# EAGLE design 12v-5v_Buck_Converter (EAGLE 9.6.2)
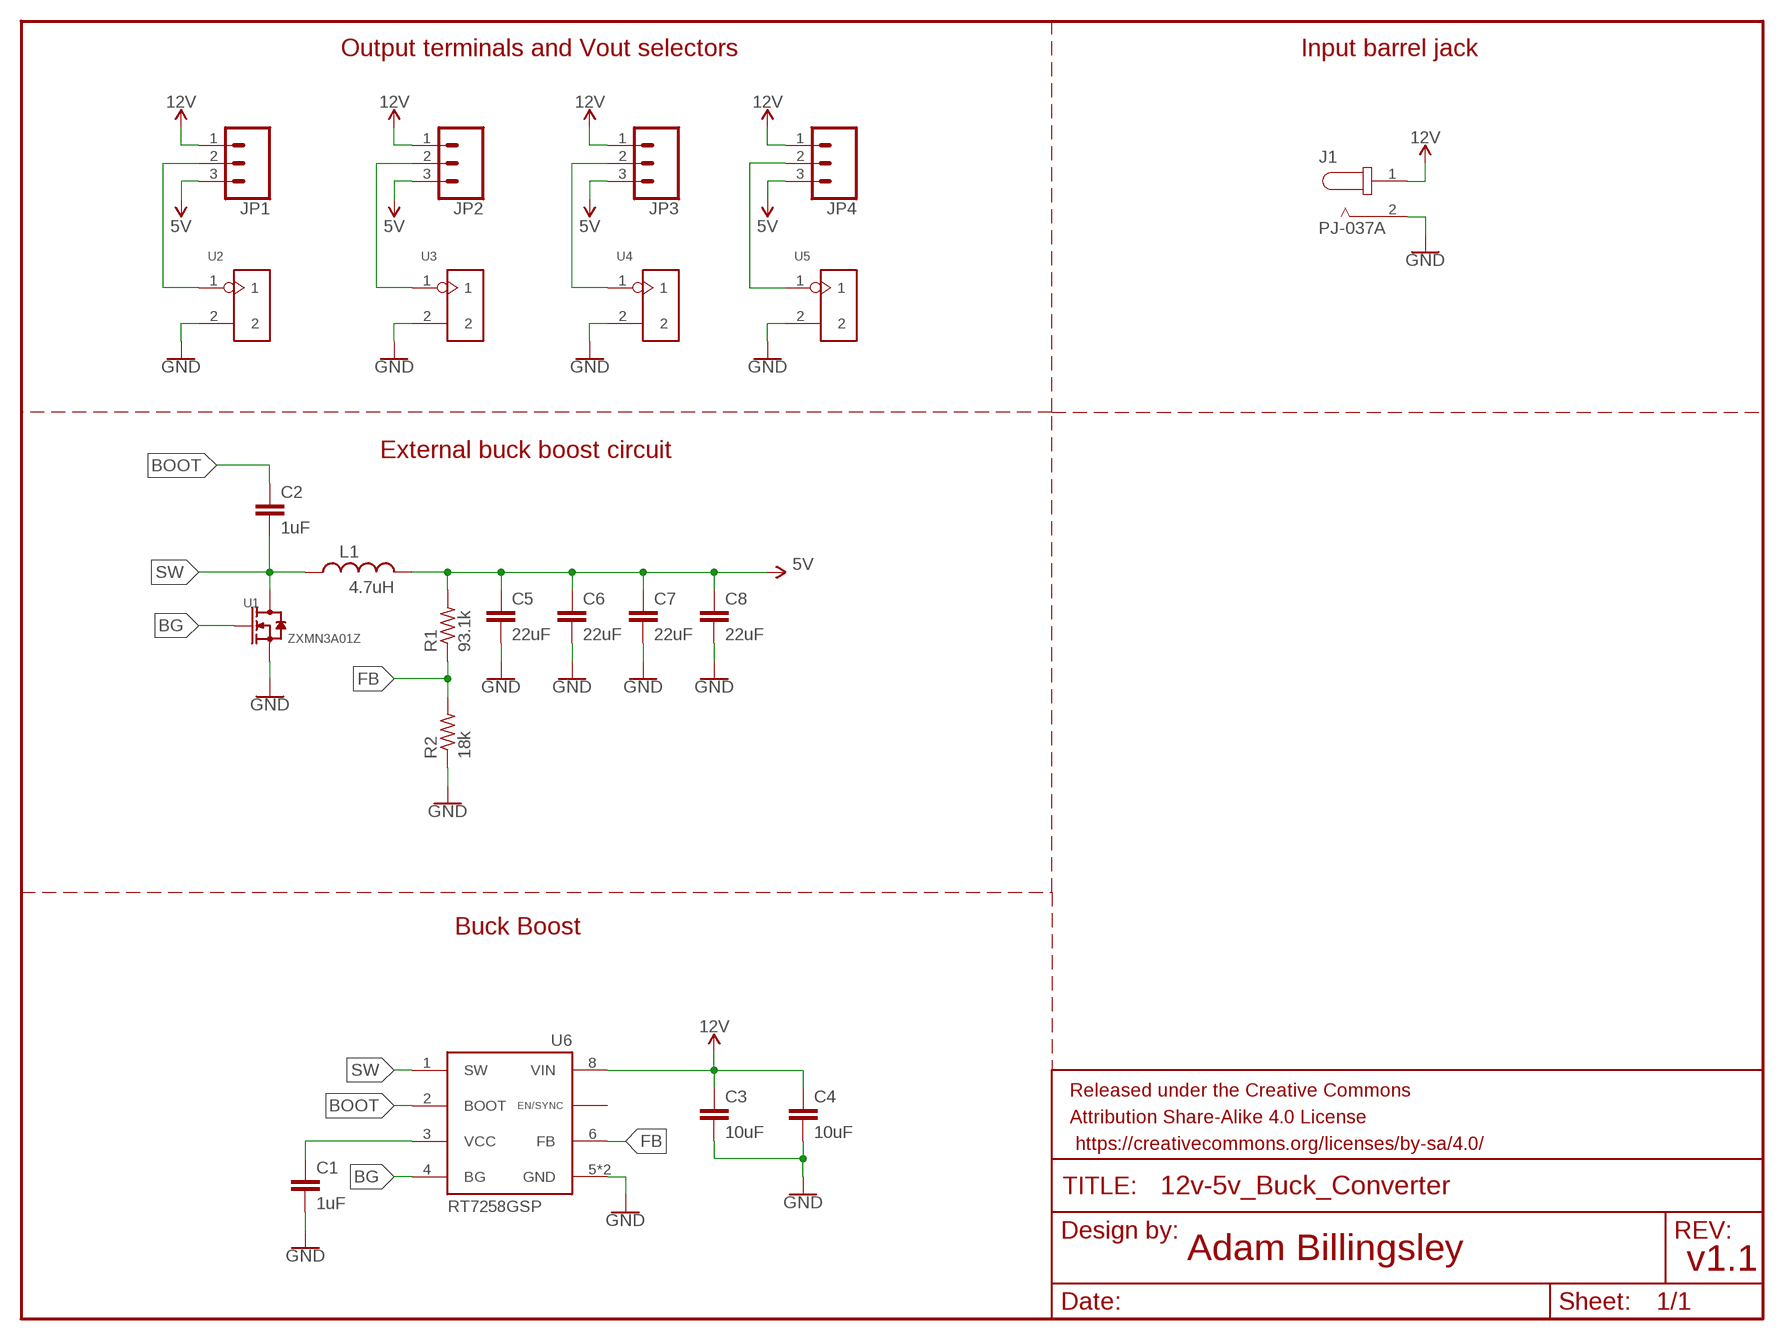
[diagram p0: schematic, sheet 1]

## Parts
C1  1uF  1206_CAPACITOR  [1206-CAPACITOR]
C2  1uF  1206_CAPACITOR  [1206-CAPACITOR]
C3  10uF  1206_CAPACITOR  [1206-CAPACITOR]
C4  10uF  1206_CAPACITOR  [1206-CAPACITOR]
C5  22uF  1210_CAPACITOR  [1210]
C6  22uF  1210_CAPACITOR  [1210]
C7  22uF  1210_CAPACITOR  [1210]
C8  22uF  1210_CAPACITOR  [1210]
FRAME1  FRAME-LETTER  [CREATIVE_COMMONS]
J1  PJ-037A  [CUI_PJ-037A]
JP1  1X03  [1X03]
JP2  1X03  [1X03]
JP3  1X03  [1X03]
JP4  1X03  [1X03]
L1  4.7uH  INDUCTOR_7443330470  [INDUCTOR-7443330470]
R1  93.1k  1206_RESISTOR  [1206-CAPACITOR]
R2  18k  1206_RESISTOR  [1206-CAPACITOR]
U1  ZXMN3A01Z  MOSFET-N-SI7114DN  [SI7114DN]
U2  TERMINAL_BLOCK_2P  [H2-5.0-10.5X8.0MM]
U3  TERMINAL_BLOCK_2P  [H2-5.0-10.5X8.0MM]
U4  TERMINAL_BLOCK_2P  [H2-5.0-10.5X8.0MM]
U5  TERMINAL_BLOCK_2P  [H2-5.0-10.5X8.0MM]
U6  RT7258GSP  [SOP-8E]

## Nets
5V: C5.1 C6.1 C7.1 C8.1 JP1.3 JP2.3 JP3.3 JP4.3 L1.2 R1.2
12V: C3.1 C4.1 J1.1 JP1.1 JP2.1 JP3.1 JP4.1 U6.8(VIN)
BG: U1.4(G) U6.4(BG)
BOOT: C2.1 U6.2(BOOT)
FB: R1.1 R2.2 U6.6(FB)
GND: C1.2 C3.2 C4.2 C5.2 C6.2 C7.2 C8.2 J1.2 R2.1 U1.1(S) U1.2(S) U1.3(S) U2.2 U3.2 U4.2 U5.2 U6.5(GND) U6.9(GND)
N$1: C1.1 U6.3(VCC)
N$2: JP4.2 U5.1
N$3: JP3.2 U4.1
N$4: JP2.2 U3.1
N$5: JP1.2 U2.1
SW: C2.2 L1.1 U1.5(D) U1.6(D) U1.7(D) U1.8(D) U1.9(D) U6.1(SW)
Unconnected: U6.7(EN/SYNC)

## Notes on the sheet
- Output terminals and Vout selectors | Input barrel jack
- External buck boost circuit
- Buck Boost
- Adam Billingsley
- v1.1

## Library data of the parts
C1-C4 = Adam's Parts (work):1206_CAPACITOR
C5-C8 = Adam's Parts (work):1210_CAPACITOR
FRAME1 = SparkFun-Aesthetics:FRAME-LETTER: Schematic Frame - Letter Standard 8.5x11 US Letter frame
J1 = PJ-037A:PJ-037A: 2.0 mm Center Pin, 2.5 A, Right Angle, Through Hole, Dc Power Jack Connector; MANUFACTURER: CUI INC; STANDARD: Manufacturer recommendations
JP1-JP4 = Adam's Parts (work):1X03
L1 = Adam's Parts (work):INDUCTOR_7443330470
R1 R2 = Adam's Parts (work):1206_RESISTOR
U1 = Adam's Parts (work):MOSFET-N-SI7114DN
U2-U5 = Adam's Parts (work):TERMINAL_BLOCK_2P
U6 = Adam's Parts (work):RT7258GSP

## Board
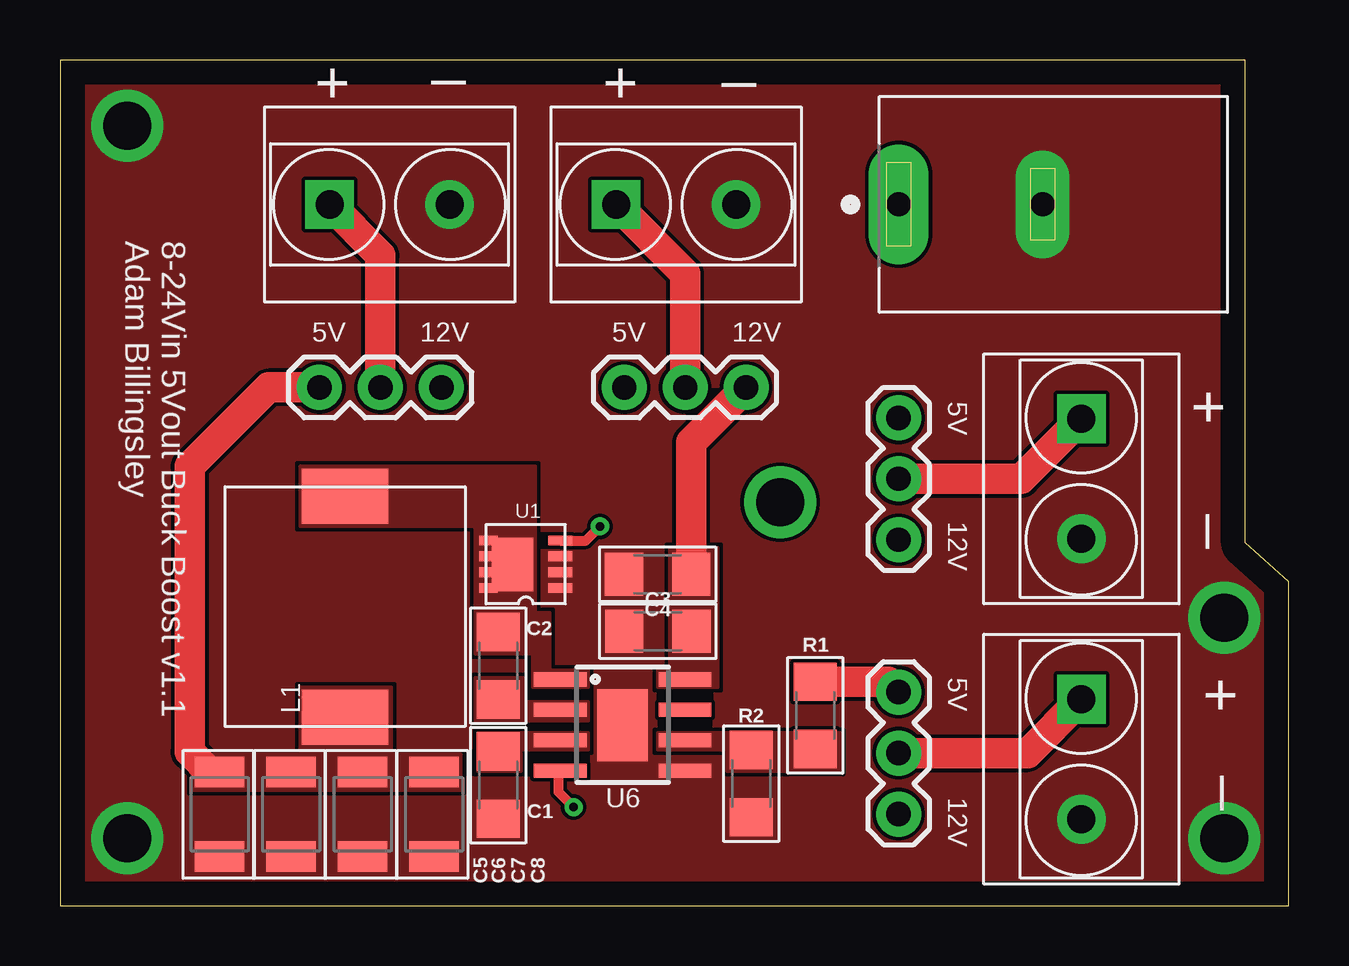
[diagram p1: board, top side]
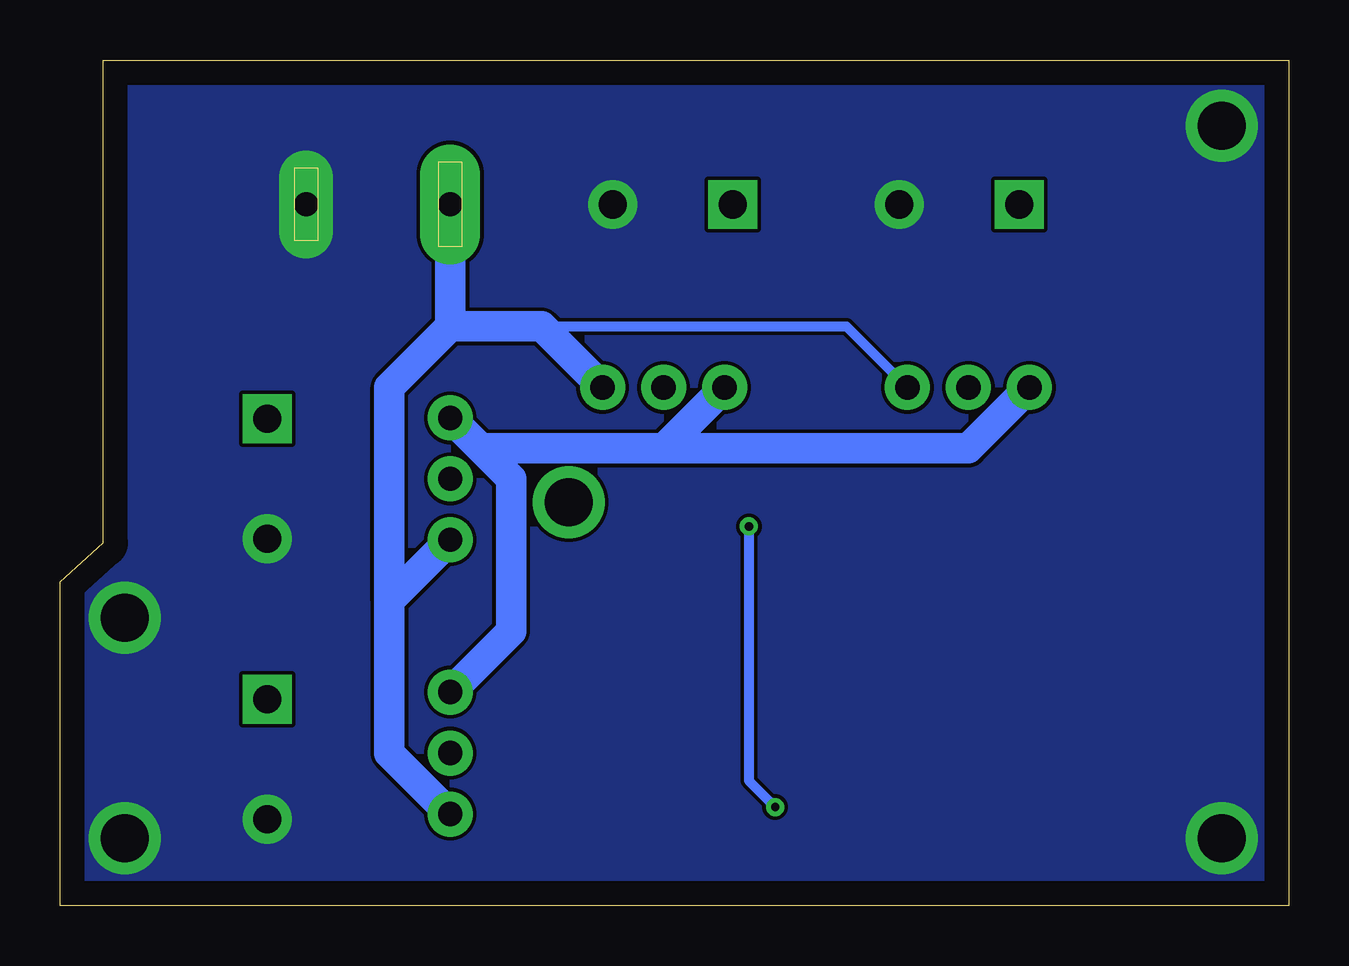
[diagram p2: board, bottom side, seen from below]

Size 51.2 x 35.23 mm. Coordinates in mm from the lower left corner, seen from the top.
Outline: 0,0 51.2,0 51.2,13.5 49.39,15.11 49.39,35.23 0,35.23 0,0
Copper layers (1*16): Top 0.035mm / dielectric 1.5mm / Bottom 0.035mm
Design rules "default": minimum track width 6mil, minimum drill 0.35mm, track to track 6mil, track to pad 6mil, pad to pad 6mil, via to via 6mil, smd to smd 6mil, copper to edge 40mil, drill to drill 6mil, minimum pad ring 10mil, minimum via ring 8mil, stop-mask expansion 4mil, vias tented up to drill 0mil, thermal gap 10mil

### Footprints (pad centres in the part's own frame; a part is rotated, then mirrored left to right if it is on the bottom)
1206-CAPACITOR = smd 1.6 x 1.8: 1 -1.4,0; 2 1.4,0
1210 = smd 1.27 x 2.06: 1 -1.755,0; 2 1.755,0
CUI_PJ-037A = drill 1 pad 2.5 long: 1 0,0 | drill 1 pad 2.25 long: 2 6,0
1X03 = drill 1.016 pad 1.88: 1 0,0; 2 2.54,0; 3 5.08,0
INDUCTOR-7443330470 = smd 2.3 x 3.6: 1 4.6,0; 2 -4.6,0
SI7114DN = smd 0.99 x 0.405: 1 0.495,2.183; 2 0.495,1.522; 3 0.495,0.863; 4 0.495,0.203 | smd 0.76 x 0.405: 5 3.48,0.203; 6 3.48,0.863; 7 3.48,1.522; 8 3.48,2.183 | smd 1.725 x 2.235: 9 2.487,1.195
H2-5.0-10.5X8.0MM = drill 1.168 pad 2.032 square: 1 0,2.5 | drill 1.168 pad 2.032: 2 0,-2.5
SOP-8E = smd 0.6 x 2.2: 1 -1.905,-2.6; 2 -0.635,-2.6; 3 0.635,-2.6; 4 1.905,-2.6; 5 1.905,2.6; 6 0.635,2.6; 7 -0.635,2.6; 8 -1.905,2.6 | smd 3 x 2.1: 9 0,0

### Placement (x,y rotation side)
C1  18.26,5.01 270 top
C2  18.26,9.99 90 top
C3  24.91,11.43 180 top
C4  24.9,13.8 180 top
C5  15.59,3.8 270 top
C6  12.61,3.8 270 top
C7  9.63,3.8 270 top
C8  6.65,3.8 270 top
FRAME1  21,-8 0 bottom  (outside the outline)
J1  34.94,29.21 0 top
JP1  34.94,3.81 90 top
JP2  34.94,15.24 90 top
JP3  28.59,21.59 180 top
JP4  15.89,21.59 180 top
L1  11.88,12.45 90 top
R1  31.47,7.92 90 top
R2  28.8,5.08 90 top
U1  21.34,15.41 180 top
U2  42.56,6.1 0 top
U3  42.56,17.78 0 top
U4  25.67,29.21 90 top
U5  13.73,29.21 90 top
U6  23.44,7.52 270 top

### Tracks (layer width: path | path; a pad name or v marks a point on that pad's centre or on a via)
5V
  Top 0.406: 6.25,5.55 C8.1
  Top 1.27: JP4.3 8.69,21.59 5.4,18.3 5.4,6.4 6.25,5.55 | R1.2 34.51,9.32 JP1.3
  Bottom 1.27: JP2.3 33.67,19.05 | JP4.3 13.35,19.05 26.05,19.05 | 33.67,19.05 26.05,19.05 | JP3.3 26.05,19.05 | JP1.3 32.4,11.43 32.4,17.78 33.67,19.05
  pour Top (no thermals): 5.5,4.8 5.5,6.3 10,6.3 10,9.1 13.8,9.1 13.8,6.3 16.7,6.3 16.7,4.8
12V
  Top 1.27: C4.1 26.3,19.3 JP3.1
  Bottom 0.406: 31.13,24.13 18.43,24.13 JP4.1
  Bottom 1.27: JP2.1 37.48,12.7 | JP1.1 37.48,6.35 37.48,12.7 | 37.48,12.7 37.48,21.59 34.94,24.13 | 34.94,24.13 31.13,24.13 JP3.1 | J1.1 34.94,24.13
  pour Top (no thermals): 24.9,9.1 24.9,9.8 25.4,9.8 25.4,14.9 27.4,14.9 27.4,9.1
BG  (via drill 0.35)
  Top 0.152: 20.77,5.55 U6.4
  Top 0.406: U1.4 21.91,15.21 v22.5,15.8 | v21.4,4.1 20.77,4.73 20.77,5.55
  Bottom 0.406: v22.5,15.8 22.5,5.2 v21.4,4.1
BOOT
  pour Top (no thermals): 17.3,7.7 22,7.7 22,8.5 19.3,8.5 19.3,9.5 17.3,9.5
FB
  pour Top (no thermals): 32.5,7.2 24.9,7.2 24.9,6.5 27.8,6.5 27.8,5.6 32.5,5.6
GND  (via drill 2)
  other vias: 2.8,2.8 2.8,32.5 48.5,2.8 48.5,12
  pour Top (rank 2, no thermals): 0,0 0,35.05 51.28,35.05 51.28,0
  pour Bottom (no thermals): 0,0 0,35.2 51.4,35.2 51.4,0
N$1
  pour Top (no thermals): 22,7.2 17.4,7.2 17.4,5.6 19.2,5.6 19.2,6.5 22,6.5
N$2
  Top 1.27: U5.1 13.35,27.09 JP4.2
N$3
  Top 1.27: U4.1 26.05,26.33 JP3.2
N$4
  Top 1.27: U3.1 40.06,17.78 JP2.2
N$5
  Top 1.27: U2.1 40.31,6.35 JP1.2
N$8  (via drill 2)
  other vias: 30,16.8
SW
  Top 0.152: 20.27,9.43 U6.1
  pour Top (no thermals): 22,9.1 19.7,9.1 19.7,10.5 17.3,10.5 17.3,15.8 10,15.8 10,18.3 19.8,18.3 19.8,12.2 20.4,12.2 20.4,9.8 22,9.8

### Text on the board
tPlace: + | _ | + | _ | 8-24Vin 5Vout Buck Boost v1.1 / Adam Billingsley | 5V | 12V | 5V | 12V | + | 5V | 12V | _ | 5V | + | L1 | 12V | _